# Altium schematic sheet TriDeer.SchDoc
size A3
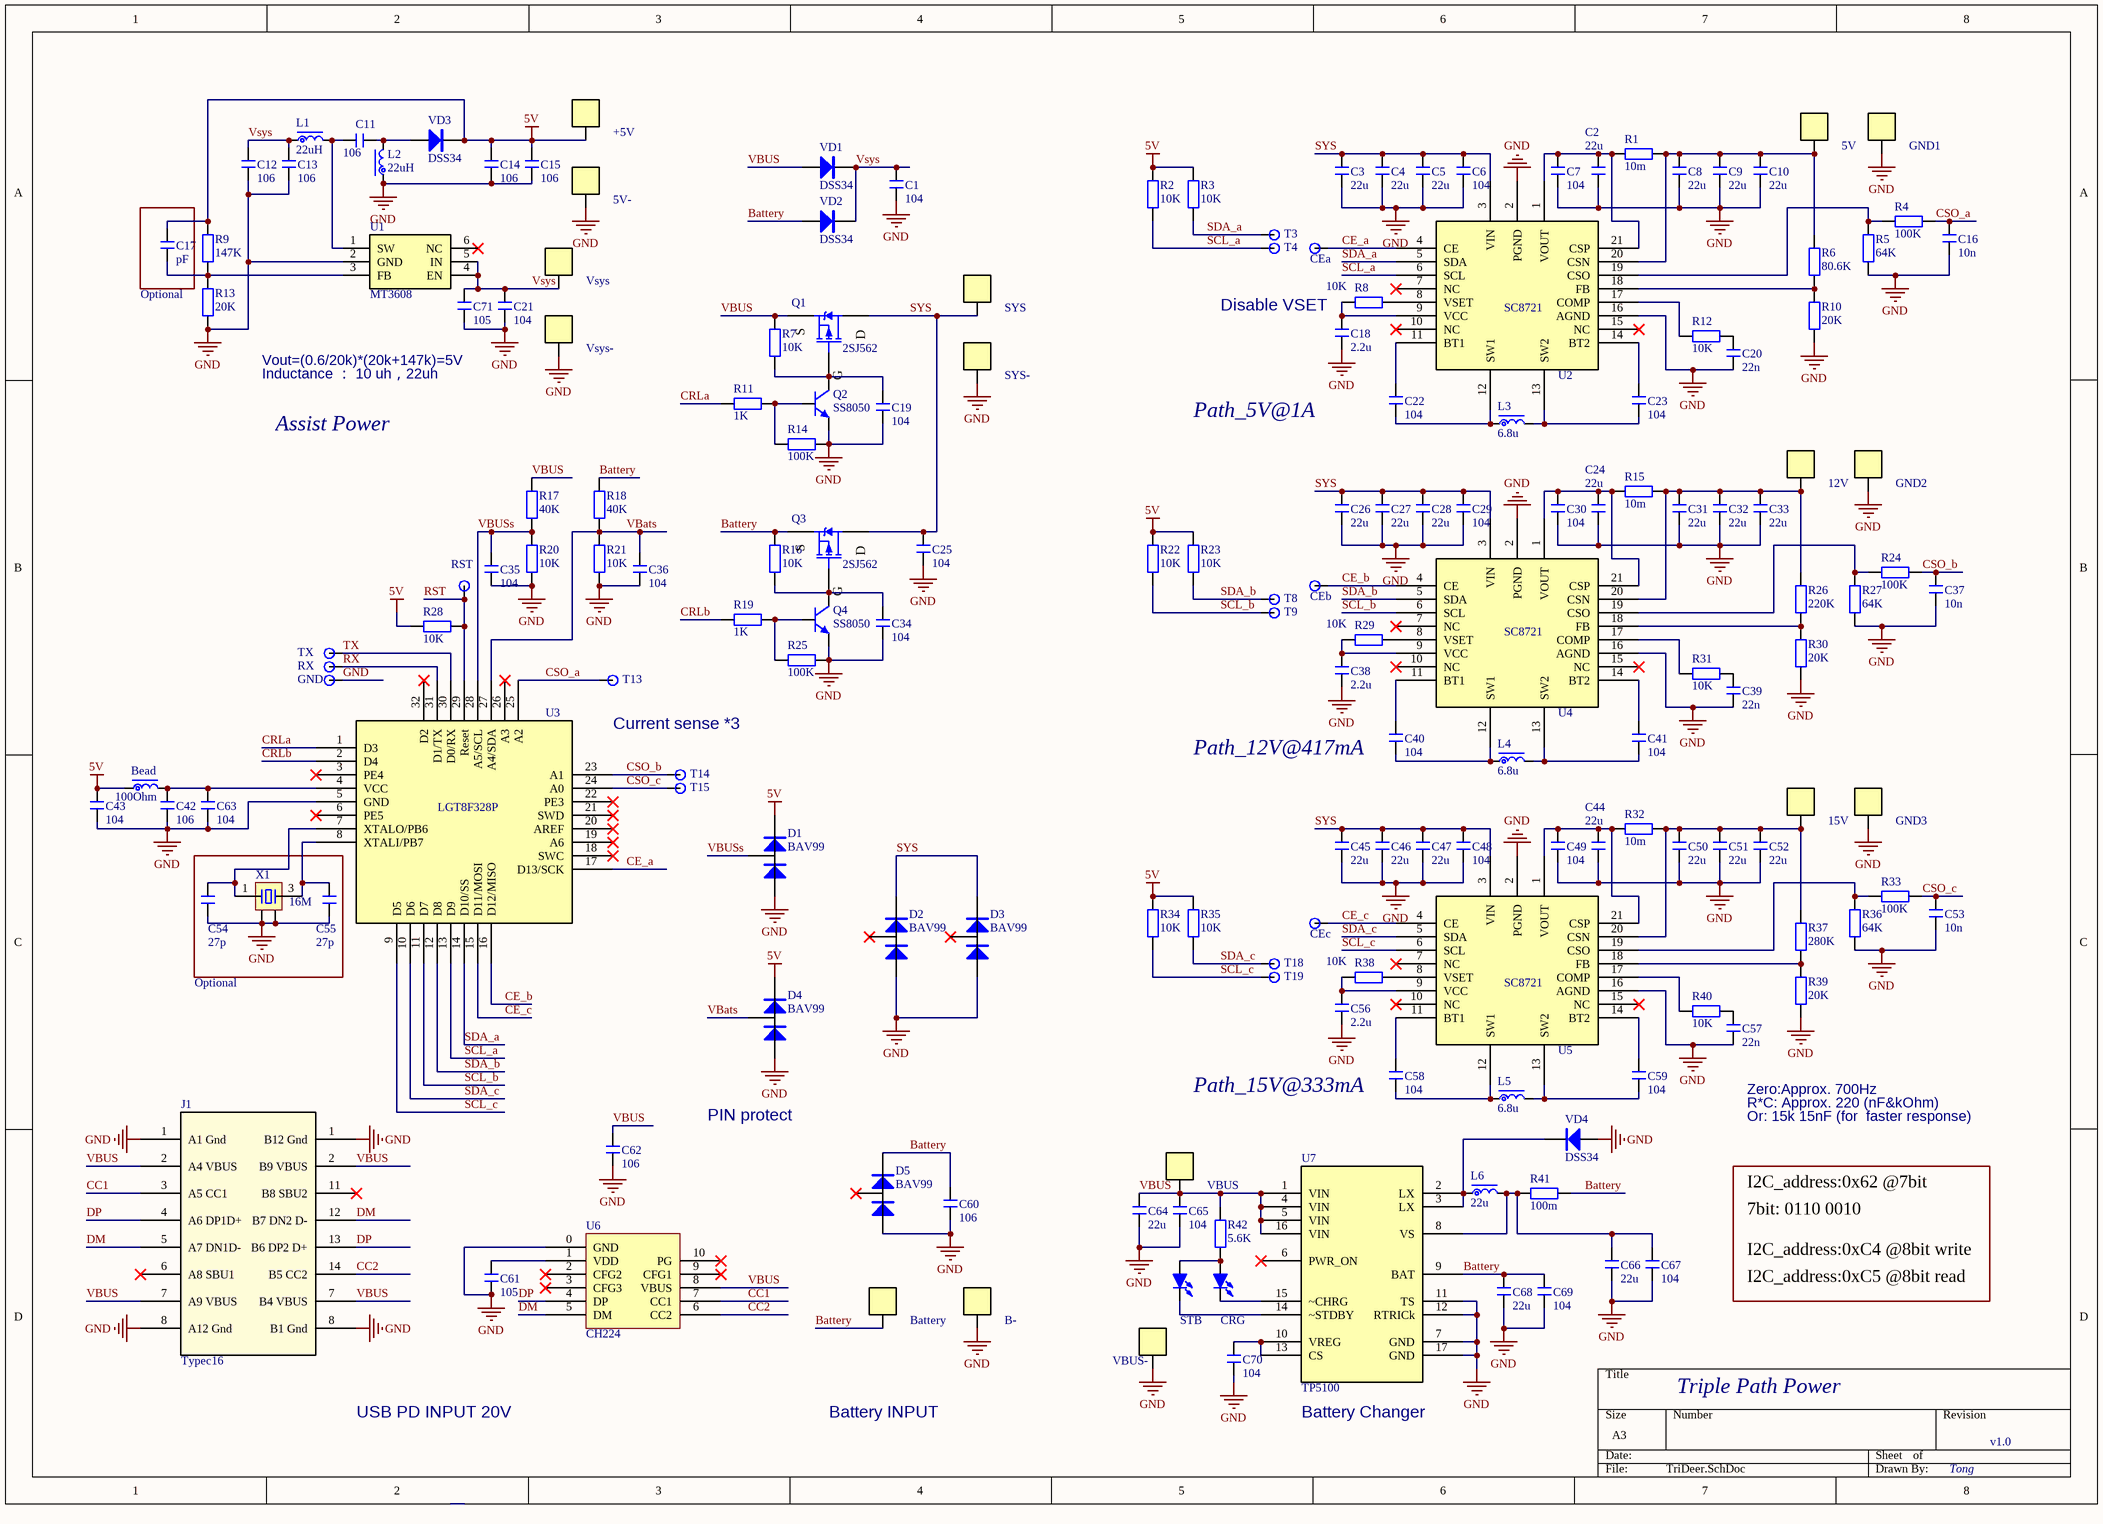
[diagram p0: TriDeer.SchDoc]

## Parts
5V  1  [connect]  (value not drawn)
5V-  1  [connect]  (value not drawn)
12V  1  [connect]  (value not drawn)
15V  1  [connect]  (value not drawn)
+5V  1  [connect]  (value not drawn)
B-  1  [connect]  (value not drawn)
Battery  1  [connect]  (value not drawn)
Bead  100Ohm  [L 0805]
C1  104  [C 0603]
C2  22u  [C 0805]
C3  22u  [C 0805]
C4  22u  [C 0805]
C5  22u  [C 0805]
C6  104  [C 0603]
C7  104  [C 0603]
C8  22u  [C 0805]
C9  22u  [C 0805]
C10  22u  [C 0805]
C11  106  [C 0805]
C12  106  [C 0805]
C13  106  [C 0805]
C14  106  [C 0805]
C15  106  [C 0805]
C16  10n  [C 0603]
C17  pF  [C 0603]
C18  2.2u  [C 0603]
C19  104  [C 0603]
C20  22n  [C 0603]
C21  104  [C 0603]
C22  104  [C 0603]
C23  104  [C 0603]
C24  22u  [C 0805]
C25  104  [C 0603]
C26  22u  [C 0805]
C27  22u  [C 0805]
C28  22u  [C 0805]
C29  104  [C 0603]
C30  104  [C 0603]
C31  22u  [C 0805]
C32  22u  [C 0805]
C33  22u  [C 0805]
C34  104  [C 0603]
C35  104  [C 0603]
C36  104  [C 0603]
C37  10n  [C 0603]
C38  2.2u  [C 0603]
C39  22n  [C 0603]
C40  104  [C 0603]
C41  104  [C 0603]
C42  106  [C 0805]
C43  104  [C 0603]
C44  22u  [C 0805]
C45  22u  [C 0805]
C46  22u  [C 0805]
C47  22u  [C 0805]
C48  104  [C 0603]
C49  104  [C 0603]
C50  22u  [C 0805]
C51  22u  [C 0805]
C52  22u  [C 0805]
C53  10n  [C 0603]
C54  27p  [C 0603]
C55  27p  [C 0603]
C56  2.2u  [C 0603]
C57  22n  [C 0603]
C58  104  [C 0603]
C59  104  [C 0603]
C60  106  [C 0805]
C61  105  [C 0603]
C62  106  [C 0805]
C63  104  [C 0603]
C64  22u  [C 0805]
C65  104  [C 0603]
C66  22u  [C 0805]
C67  104  [C 0603]
C68  22u  [C 0805]
C69  104  [C 0603]
C70  104  [C 0603]
C71  105  [C 0603]
CEa  test  [TEST 1.6]  (value not drawn)
CEb  test  [TEST 1.6]  (value not drawn)
CEc  test  [TEST 1.6]  (value not drawn)
CRG  红色  [LED 0603B]  (value not drawn)
D1  BAV99  [SOT23-3N]
D2  BAV99  [SOT23-3N]
D3  BAV99  [SOT23-3N]
D4  BAV99  [SOT23-3N]
D5  BAV99  [SOT23-3N]
GND  test  [TEST 1.6]  (value not drawn)
GND1  1  [connect]  (value not drawn)
GND2  1  [connect]  (value not drawn)
GND3  1  [connect]  (value not drawn)
J1  Typec16  [typec 16p]
L1  22uH  [L252010]
L2  22uH  [L252010]
L3  6.8u  [R0624]
L4  6.8u  [R0624]
L5  6.8u  [R0624]
L6  22u  [R0624]
Q1  2SJ562  [SOT89]
Q2  SS8050  [SOT23-3N]
Q3  2SJ562  [SOT89]
Q4  SS8050  [SOT23-3N]
R1  10m  [Res-SMD-0805]
R2  10K  [Res-SMD-0603]
R3  10K  [Res-SMD-0603]
R4  100K  [Res-SMD-0603]
R5  64K  [Res-SMD-0603]
R6  80.6K  [Res-SMD-0603]
R7  10K  [Res-SMD-0603]
R8  10K  [Res-SMD-0603]
R9  147K  [Res-SMD-0603]
R10  20K  [Res-SMD-0603]
R11  1K  [Res-SMD-0603]
R12  10K  [Res-SMD-0603]
R13  20K  [Res-SMD-0603]
R14  100K  [Res-SMD-0603]
R15  10m  [Res-SMD-0805]
R16  10K  [Res-SMD-0603]
R17  40K  [Res-SMD-0603]
R18  40K  [Res-SMD-0603]
R19  1K  [Res-SMD-0603]
R20  10K  [Res-SMD-0603]
R21  10K  [Res-SMD-0603]
R22  10K  [Res-SMD-0603]
R23  10K  [Res-SMD-0603]
R24  100K  [Res-SMD-0603]
R25  100K  [Res-SMD-0603]
R26  220K  [Res-SMD-0603]
R27  64K  [Res-SMD-0603]
R28  10K  [Res-SMD-0603]
R29  10K  [Res-SMD-0603]
R30  20K  [Res-SMD-0603]
R31  10K  [Res-SMD-0603]
R32  10m  [Res-SMD-0805]
R33  100K  [Res-SMD-0603]
R34  10K  [Res-SMD-0603]
R35  10K  [Res-SMD-0603]
R36  64K  [Res-SMD-0603]
R37  280K  [Res-SMD-0603]
R38  10K  [Res-SMD-0603]
R39  20K  [Res-SMD-0603]
R40  10K  [Res-SMD-0603]
R41  100m  [Res-SMD-1206]
R42  5.6K  [Res-SMD-0603]
RST  test  [TEST 1.6]  (value not drawn)
RX  test  [TEST 1.6]  (value not drawn)
STB  红色  [LED 0603B]  (value not drawn)
SYS  1  [connect]  (value not drawn)
SYS-  1  [connect]  (value not drawn)
T3  test  [TEST 1.6]  (value not drawn)
T4  test  [TEST 1.6]  (value not drawn)
T8  test  [TEST 1.6]  (value not drawn)
T9  test  [TEST 1.6]  (value not drawn)
T13  test  [TEST 1.6]  (value not drawn)
T14  test  [TEST 1.6]  (value not drawn)
T15  test  [TEST 1.6]  (value not drawn)
T18  test  [TEST 1.6]  (value not drawn)
T19  test  [TEST 1.6]  (value not drawn)
TX  test  [TEST 1.6]  (value not drawn)
U1  MT3608  [SOT23-6N]
U2  SC8721  [QFN-21_L4.0-W4.0-P0.40-BL_SC8721QFER]
U3  LGT8F328P  [TQFP32 7x7_N]
U4  SC8721  [QFN-21_L4.0-W4.0-P0.40-BL_SC8721QFER]
U5  SC8721  [QFN-21_L4.0-W4.0-P0.40-BL_SC8721QFER]
U6  CH224  [SOP10_N]
U7  TP5100  [TQFN-16_L4.0-W4.0-P0.65-BL-EP]
VBUS  1  [connect]  (value not drawn)
VBUS-  1  [connect]  (value not drawn)
VD1  DSS34  [SOD-123F]
VD2  DSS34  [SOD-123F]
VD3  DSS34  [SOD-123F]
VD4  DSS34  [SOD-123F]
Vsys  1  [connect]  (value not drawn)
Vsys-  1  [connect]  (value not drawn)
X1  16M  [XTAL-3225]

## Nets
5V: +5V.1 Bead.1 C14.2 C15.2 C17.2 C43.1 D1.2 D4.2 R2.1 R3.1 R9.2 R22.1 R23.1 R28.1 R34.1 R35.1 VD3.2(K)
GND: 5V-.1 B-.1 C1.2 C2.2 C3.2 C4.2 C5.2 C6.2 C7.2 C8.2 C9.2 C10.2 C12.1 C13.1 C14.1 C15.1 C16.2 C18.2 C19.1 C20.1 C21.2 C24.2 C25.2 C26.2 C27.2 C28.2 C29.2 C30.2 C31.2 C32.2 C33.2 C34.1 C35.1 C36.1 C37.2 C38.2 C39.1 C42.2 C43.2 C44.2 C45.2 C46.2 C47.2 C48.2 C49.2 C50.2 C51.2 C52.2 C53.2 C54.2 C55.2 C56.2 C57.1 C60.1 C61.2 C62.1 C63.2 C64.2 C65.2 C66.2 C67.2 C68.2 C69.2 C70.2 C71.2 D1.1 D2.1 D3.1 D4.1 D5.1 GND.1 GND1.1 GND2.1 GND3.1 J1.1(A1_Gnd) J1.8(A12_Gnd) L2.1 Q2.2(E) Q4.2(E) R5.2 R10.2 R13.1 R14.1 R20.2 R21.2 R25.1 R27.2 R30.2 R36.2 R39.2 SYS-.1 U1.2(GND) U2.2(PGND) U2.16(AGND) U3.5(GND) U4.2(PGND) U4.16(AGND) U5.2(PGND) U5.16(AGND) U6.0(GND) U7.7(GND) U7.11(TS) U7.12(RTRICk) U7.17(GND) VBUS-.1 VD4.1(A) Vsys-.1 X1.2 X1.4
Battery: Battery.1 C60.2 C68.1 C69.1 D5.2 Q3.3(S) R16.1 R18.1 R41.2 U7.9(BAT) VD2.1(A)
CC1: J1.3(A5_CC1) U6.7(CC1)
CC2: J1.14(B5_CC2) U6.6(CC2)
CE_a: CEa.1 U2.4(CE) U3.17(D13/SCK)
CE_b: CEb.1 U3.16(D12/MISO) U4.4(CE)
CE_c: CEc.1 U3.15(D11/MOSI) U5.4(CE)
CRLa: R11.2 U3.1(D3)
CRLb: R19.2 U3.2(D4)
CSO_a: C16.1 R4.1 T13.1 U3.25(A2)
CSO_b: C37.1 R24.1 T14.1 U3.23(A1)
CSO_c: C53.1 R33.1 T15.1 U3.24(A0)
DM: J1.5(A7_DN1D-) J1.12(B7_DN2_D-) U6.5(DM)
DP: J1.4(A6_DP1D+) J1.13(B6_DP2_D+) U6.4(DP)
RST: R28.2 RST.1 U3.29(Reset)
RX: RX.1 U3.31(D1/TX)
SCL_a: R2.2 T4.1 U2.6(SCL) U3.13(D9)
SCL_b: R22.2 T9.1 U3.11(D7) U4.6(SCL)
SCL_c: R34.2 T19.1 U3.9(D5) U5.6(SCL)
SDA_a: R3.2 T3.1 U2.5(SDA) U3.14(D10/SS)
SDA_b: R23.2 T8.1 U3.12(D8) U4.5(SDA)
SDA_c: R35.2 T18.1 U3.10(D6) U5.5(SDA)
SYS: C3.1 C4.1 C5.1 C6.1 C25.1 C26.1 C27.1 C28.1 C29.1 C45.1 C46.1 C47.1 C48.1 D2.2 D3.2 Q1.2(D) Q3.2(D) SYS.1 U2.3(VIN) U4.3(VIN) U5.3(VIN)
TX: TX.1 U3.30(D0/RX)
VBats: C36.2 D4.3 R18.2 R21.1 U3.27(A4/SDA)
VBUS: C62.2 C64.1 C65.1 J1.2(A4_VBUS) J1.7(A9_VBUS) Q1.3(S) R7.1 R17.1 R42.1 U6.8(VBUS) U7.1(VIN) U7.4(VIN) U7.5(VIN) U7.16(VIN) VBUS.1 VD1.1(A)
VBUSs: C35.2 D1.3 R17.2 R20.1 U3.28(A5/SCL)
Vsys: C1.1 C12.2 C13.2 C21.1 C71.1 L1.1 U1.4(EN) U1.5(IN) VD1.2(K) VD2.2(K) Vsys.1
Net5V_1: 5V.1 C8.1 C9.1 C10.1 R1.2 R6.1 U2.20(CSN)
Net12V_1: 12V.1 C31.1 C32.1 C33.1 R15.2 R26.1 U4.20(CSN)
Net15V_1: 15V.1 C50.1 C51.1 C52.1 R32.2 R37.1 U5.20(CSN)
NetBead_2: Bead.2 C42.1 C63.1 U3.4(VCC)
NetC2_1: C2.1 C7.1 R1.1 U2.1(VOUT) U2.21(CSP)
NetC11_1: C11.1 L1.2 U1.1(SW)
NetC11_2: C11.2 L2.2 VD3.1(A)
NetC17_1: C17.1 R9.1 R13.2 U1.3(FB)
NetC18_1: C18.1 R8.1 U2.9(VCC)
NetC19_2: C19.2 Q1.1(G) Q2.3(C) R7.2
NetC20_2: C20.2 R12.1
NetC22_1: C22.1 U2.11(BT1)
NetC22_2: C22.2 L3.1 U2.12(SW1)
NetC23_1: C23.1 U2.14(BT2)
NetC23_2: C23.2 L3.2 U2.13(SW2)
NetC24_1: C24.1 C30.1 R15.1 U4.1(VOUT) U4.21(CSP)
NetC34_2: C34.2 Q3.1(G) Q4.3(C) R16.2
NetC38_1: C38.1 R29.1 U4.9(VCC)
NetC39_2: C39.2 R31.1
NetC40_1: C40.1 U4.11(BT1)
NetC40_2: C40.2 L4.1 U4.12(SW1)
NetC41_1: C41.1 U4.14(BT2)
NetC41_2: C41.2 L4.2 U4.13(SW2)
NetC44_1: C44.1 C49.1 R32.1 U5.1(VOUT) U5.21(CSP)
NetC54_1: C54.1 U3.7(XTALO/PB6) X1.1
NetC55_1: C55.1 U3.8(XTALI/PB7) X1.3
NetC56_1: C56.1 R38.1 U5.9(VCC)
NetC57_2: C57.2 R40.1
NetC58_1: C58.1 U5.11(BT1)
NetC58_2: C58.2 L5.1 U5.12(SW1)
NetC59_1: C59.1 U5.14(BT2)
NetC59_2: C59.2 L5.2 U5.13(SW2)
NetC61_1: C61.1 U6.1(VDD)
NetC66_1: C66.1 C67.1 L6.2 R41.1 U7.8(VS)
NetC70_1: C70.1 U7.10(VREG) U7.13(CS)
NetCRG_1: CRG.1(A) R42.2 STB.1(A)
NetCRG_2: CRG.2(K) U7.15(~CHRG)
NetL6_1: L6.1 U7.2(LX) U7.3(LX) VD4.2(K)
NetQ2_1: Q2.1(B) R11.1 R14.2
NetQ4_1: Q4.1(B) R19.1 R25.2
NetR4_2: R4.2 R5.1 U2.19(CSO)
NetR6_2: R6.2 R10.1 U2.18(FB)
NetR8_2: R8.2 U2.8(VSET)
NetR12_2: R12.2 U2.17(COMP)
NetR24_2: R24.2 R27.1 U4.19(CSO)
NetR26_2: R26.2 R30.1 U4.18(FB)
NetR29_2: R29.2 U4.8(VSET)
NetR31_2: R31.2 U4.17(COMP)
NetR33_2: R33.2 R36.1 U5.19(CSO)
NetR37_2: R37.2 R39.1 U5.18(FB)
NetR38_2: R38.2 U5.8(VSET)
NetR40_2: R40.2 U5.17(COMP)
NetSTB_2: STB.2(K) U7.14(~STDBY)

Not connected (* = marked no-connect by the designer): D2 3*; D3 3*; D5 3*; J1 6(A8_SBU1)* 11(B8_SBU2)*; U1 6(NC)*; U2 7(NC)* 10(NC)* 15(NC)*; U3 3(PE4)* 6(PE5)* 18(SWC)* 19(A6)* 20(AREF)* 21(SWD)* 22(PE3)* 26(A3)* 32(D2)*; U4 7(NC)* 10(NC)* 15(NC)*; U5 7(NC)* 10(NC)* 15(NC)*; U6 2(CFG2)* 3(CFG3)* 9(CFG1)* 10(PG)*; U7 6(PWR_ON)*

## Notes on the sheet
- (near R13) Optional
- Disable VSET
- Vout=(0.6/20k)*(20k+147k)=5V
- Inductance ： 10 uh，22uh
- Assist Power
- Path_5V@1A
- Current sense *3
- Path_12V@417mA
- Optional
- PIN protect
- Path_15V@333mA
- Zero:Approx. 700Hz
- Or: 15k 15nF (for  faster response)
- R*C: Approx. 220 (nF&kOhm)
- I2C_address:0x62 @7bit
- 7bit: 0110 0010
- I2C_address:0xC4 @8bit write
- I2C_address:0xC5 @8bit read
- Triple Path Power
- USB PD INPUT 20V
- Battery INPUT
- (near U7) Battery Changer
- v1.0
- Tong

## Library data of the parts
5V 5V- 12V 15V +5V B- Battery GND1-GND3 SYS SYS- VBUS VBUS- Vsys Vsys- = connect
Bead = BEAD
C1-C71 = Cap-CER-SMD_1: 瓷片电容-贴片
CRG STB = LED-SMD: 贴片LED
L1-L6 = Ind-Beads-SMD: 贴片电感
Q1 Q3 = 2SJ562: P沟道场效应管; 版权归属: 源创客; BOM名称: P沟道场效应管; 学习资源: www.ooocke.com
Q2 Q4 = 8050-SMD: 高频放大-NPN型; 版权归属: 源创客; 属性: 40V 1.5A 1W 100MHZ; BOM名称: 高频放大-NPN型; 学习资源: www.ooocke.com
R1-R42 = Res-Fixed-SMD: 固定电阻器-贴片
VD1-VD4 = DSS34: 肖特基二极管; 版权归属: 源创客; 属性: 40V/3A; BOM名称: 肖特基二极管; 学习资源: www.ooocke.com
X1 = XTAL-4: 4脚晶振